# EAGLE design lamloei_node32s3wroom_cp2102_10_4layers (EAGLE 7.7.0)
CNAME: LamLoei Node32S3Wroom; CREVISION: R1; DESIGNER: lamloei co.,ltd.
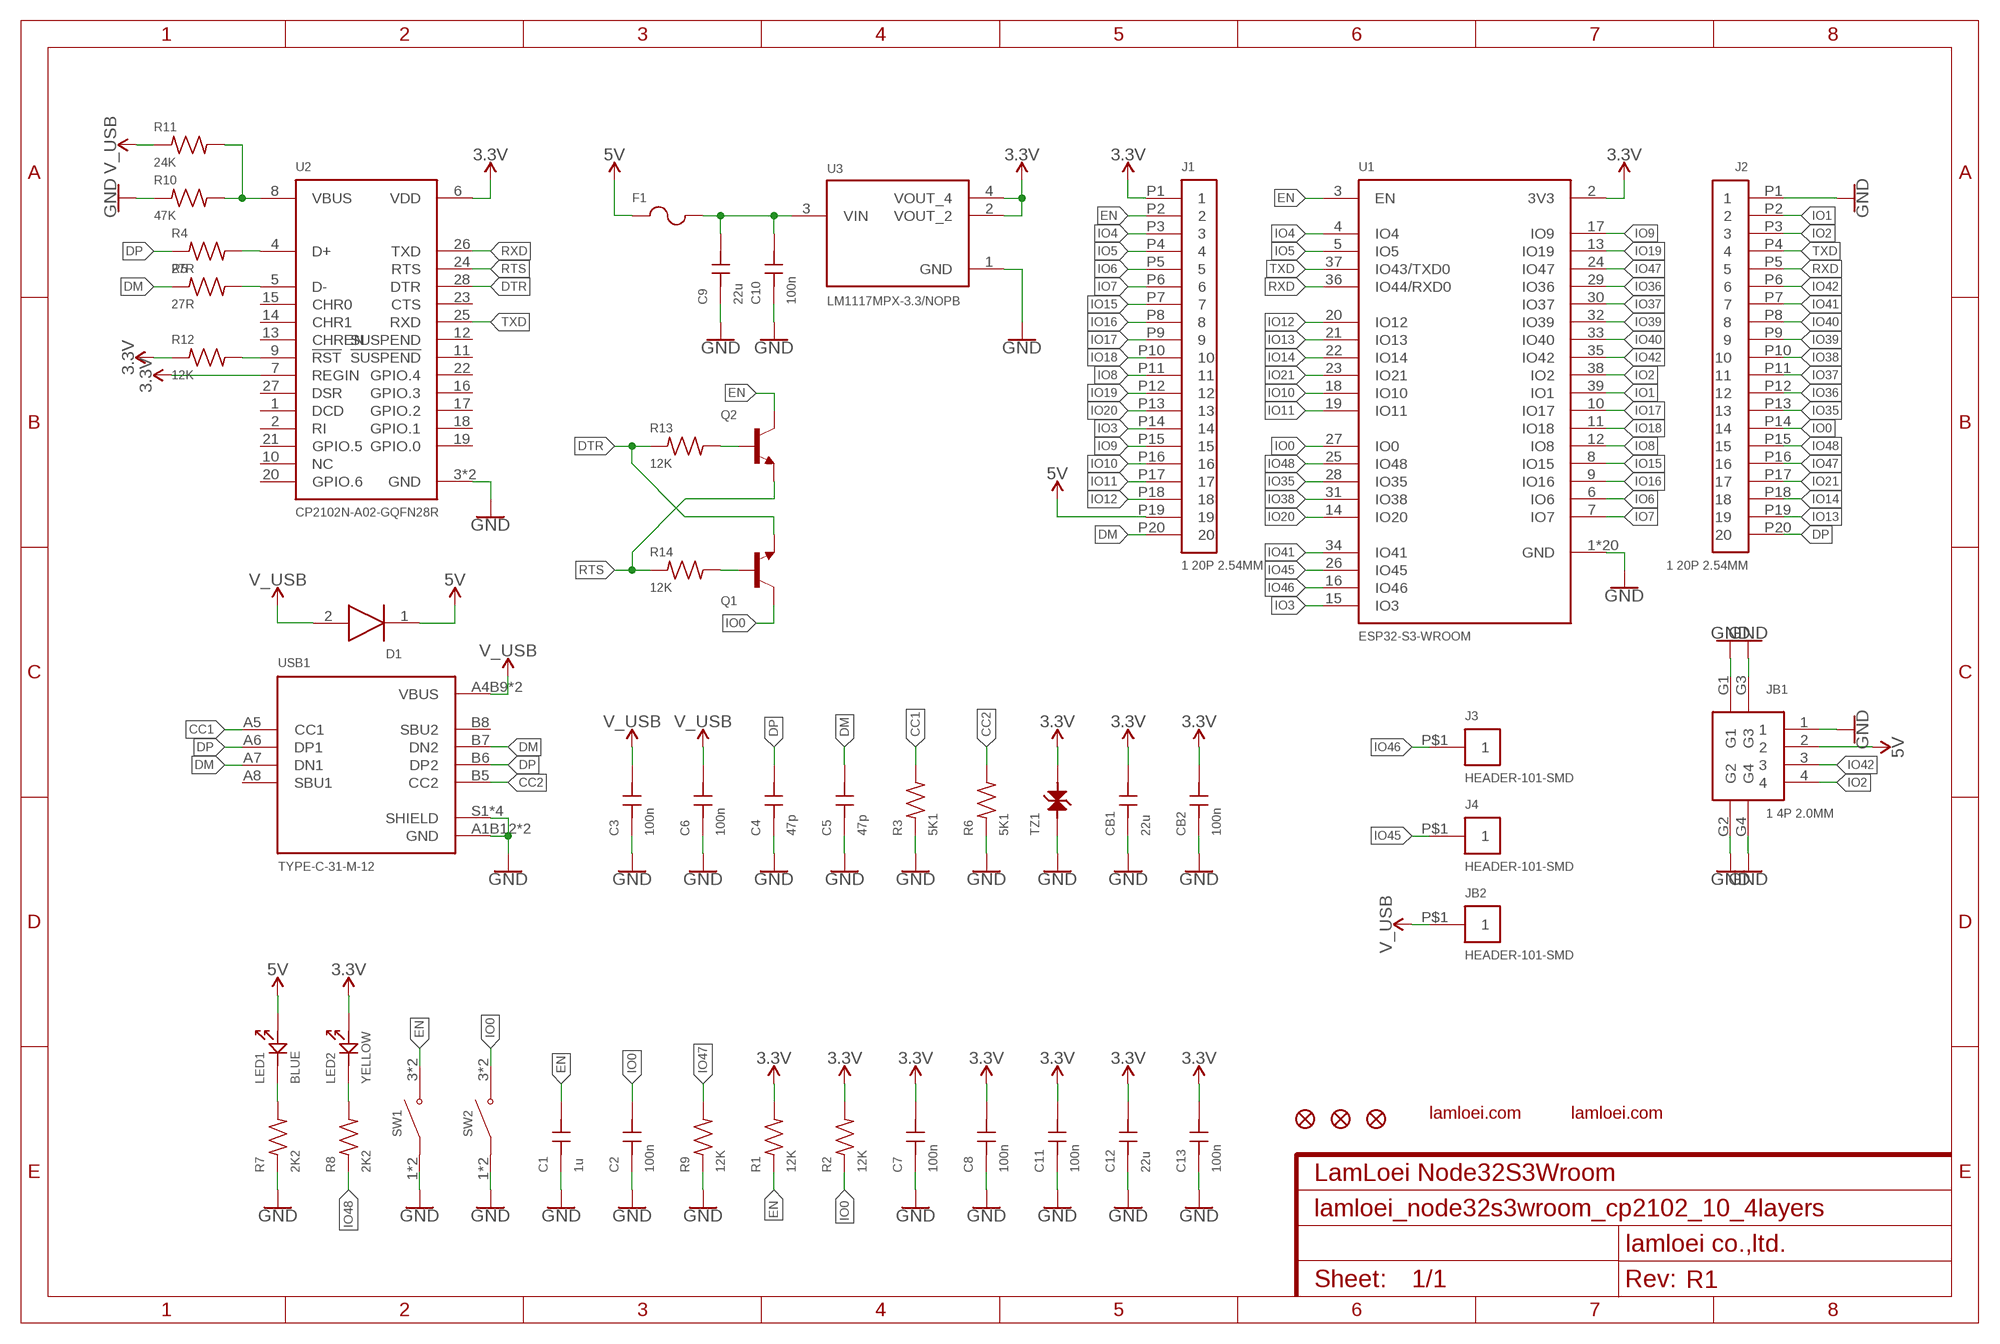
[diagram p0: schematic, sheet 1]

## Parts
C1  1u  GRM155R70J105KA12D  [GRM155R70J105KA12D]
C2  100n  GCM155R71H104KE02D  [GCM155R71H104KE02D]
C3  100n  GCM155R71H104KE02D  [GCM155R71H104KE02D]
C4  47p  GCM1555C1H470JA16D  [GCM1555C1H470JA16D]
C5  47p  GCM1555C1H470JA16D  [GCM1555C1H470JA16D]
C6  100n  GCM155R71H104KE02D  [GCM155R71H104KE02D]
C7  100n  GCM155R71H104KE02D  [GCM155R71H104KE02D]
C8  100n  GCM155R71H104KE02D  [GCM155R71H104KE02D]
C9  22u  GCM21BR71H105KA03L  [GCM21BR71H105KA03L]
C10  100n  GCM155R71H104KE02D  [GCM155R71H104KE02D]
C11  100n  GCM155R71H104KE02D  [GCM155R71H104KE02D]
C12  22u  GCM21BR71H105KA03L  [GCM21BR71H105KA03L]
C13  100n  GCM155R71H104KE02D  [GCM155R71H104KE02D]
CB1  22u  GCM21BR71H105KA03L  [GCM21BR71H105KA03L]
CB2  100n  GCM155R71H104KE02D  [GCM155R71H104KE02D]
D1  PMEG4050EP,115  [PMEG4050EP,115]
F1  MF-NSMF050-2  [MF-NSMF050-2]
J1  1 20P 2.54MM  HEADER-120  [HEADER-120]
J2  1 20P 2.54MM  HEADER-120  [HEADER-120]
J3  HEADER-101-SMD  [HEADER-101-SMD]
J4  HEADER-101-SMD  [HEADER-101-SMD]
JB1  1 4P 2.0MM  A2012WR-S-4P  [A2012WR-S-4P]
JB2  HEADER-101-SMD  [HEADER-101-SMD]
LED1  BLUE  19-217BHC-ZL1M2RY3T  [19-217BHC-ZL1M2RY3T]
LED2  YELLOW  19-213/Y2C-CQ2R2L/3T(CY)  [19-213/Y2C-CQ2R2L/3T(CY)]
Q1  BC847B,215  [BC847B,215]
Q2  BC847B,215  [BC847B,215]
R1  12K  RC0402FR-0712KL  [R0402]
R2  12K  RC0402FR-0712KL  [R0402]
R3  5K1  RC0402FR-075K1L  [R0402]
R4  27R  RC0402FR-0727RL  [R0402]
R5  27R  RC0402FR-0727RL  [R0402]
R6  5K1  RC0402FR-075K1L  [R0402]
R7  2K2  RC0402FR-072K2L  [R0402]
R8  2K2  RC0402FR-072K2L  [R0402]
R9  12K  RC0402FR-0712KL  [R0402]
R10  47K  RC0402FR-0747KL  [R0402]
R11  24K  RC0402FR-0724KL  [R0402]
R12  12K  RC0402FR-0712KL  [R0402]
R13  12K  RC0402FR-0712KL  [R0402]
R14  12K  RC0402FR-0712KL  [R0402]
SW1  K2-1808SN-A4SW-01  [K2-1808SN-A4SW-01]
SW2  K2-1808SN-A4SW-01  [K2-1808SN-A4SW-01]
TZ1  LXES15AAA1-153  [LXES15AAA1-153]
U1  ESP32-S3-WROOM  [ESP32-S3-WROOM]
U2  CP2102N-A02-GQFN28R  [CP2102N-A02-GQFN28R]
U3  LM1117MPX-3.3/NOPB  [LM1117MPX-3.3/NOPB]
USB1  TYPE-C-31-M-12  [TYPE-C-31-M-12]
ZFD1  FIDUCIAL1X2  [FIDUCIAL-1X2]
ZFD2  FIDUCIAL1X2  [FIDUCIAL-1X2]
ZFD3  FIDUCIAL1X2  [FIDUCIAL-1X2]
ZL1  LAMLEOI_LOGO_3  [LAMLEOI_LOGO_3]
ZL2  LAMLEOI_LOGO_3  [LAMLEOI_LOGO_3]

## Nets
3.3V: C7.2 C8.2 C11.2 C12.2 C13.2 CB1.2 CB2.2 J1.P1 LED2.2 R1.2 R2.2 R12.1 TZ1.2 U1.2(3V3) U2.6(VDD) U2.7(REGIN) U3.2(VOUT_2) U3.4(VOUT_4)
5V: D1.1(K) F1.1 J1.P19 JB1.2 LED1.2
CC1: R3.2 USB1.A5(CC1)
CC2: R6.2 USB1.B5(CC2)
DM: C5.2 J1.P20 R5.1 USB1.A7(DN1) USB1.B7(DN2)
DP: C4.2 J2.P20 R4.1 USB1.A6(DP1) USB1.B6(DP2)
DTR: Q1.E R13.1 U2.28(DTR)
EN: C1.2 J1.P2 Q2.C R1.1 SW1.3(NO) SW1.4(NO) U1.3(EN)
GND: C1.1 C2.1 C3.1 C4.1 C5.1 C6.1 C7.1 C8.1 C9.1 C10.1 C11.1 C12.1 C13.1 CB1.1 CB2.1 J2.P1 JB1.1 JB1.G1 JB1.G2 JB1.G3 JB1.G4 R3.1 R6.1 R7.1 R9.1 R10.1 SW1.1(COM) SW1.2(COM) SW2.1(COM) SW2.2(COM) TZ1.1 U1.1(GND) U1.1.1(GND) U1.1.2(GND) U1.1.3(GND) U1.1.4(GND) U1.1.5(GND) U1.1.6(GND) U1.1.7(GND) U1.1.8(GND) U1.1.9(GND) U1.1.10(GND) U1.1.11(GND) U1.1.12(GND) U1.1.13(GND) U1.1.14(GND) U1.1.15(GND) U1.1.16(GND) U1.1.17(GND) U1.1.18(GND) U1.40(GND) U2.3(GND) U2.29(GND) U3.1(GND) USB1.A1B12(GND) USB1.B1A12(GND) USB1.S1(SHIELD) USB1.S2(SHIELD) USB1.S3(SHIELD) USB1.S4(SHIELD)
IO0: C2.2 J2.P14 Q1.C R2.1 SW2.3(NO) SW2.4(NO) U1.27(IO0)
IO1: J2.P2 U1.39(IO1)
IO2: J2.P3 JB1.4 U1.38(IO2)
IO3: J1.P14 U1.15(IO3)
IO4: J1.P3 U1.4(IO4)
IO5: J1.P4 U1.5(IO5)
IO6: J1.P5 U1.6(IO6)
IO7: J1.P6 U1.7(IO7)
IO8: J1.P11 U1.12(IO8)
IO9: J1.P15 U1.17(IO9)
IO10: J1.P16 U1.18(IO10)
IO11: J1.P17 U1.19(IO11)
IO12: J1.P18 U1.20(IO12)
IO13: J2.P19 U1.21(IO13)
IO14: J2.P18 U1.22(IO14)
IO15: J1.P7 U1.8(IO15)
IO16: J1.P8 U1.9(IO16)
IO17: J1.P9 U1.10(IO17)
IO18: J1.P10 U1.11(IO18)
IO19: J1.P12 U1.13(IO19)
IO20: J1.P13 U1.14(IO20)
IO21: J2.P17 U1.23(IO21)
IO35: J2.P13 U1.28(IO35)
IO36: J2.P12 U1.29(IO36)
IO37: J2.P11 U1.30(IO37)
IO38: J2.P10 U1.31(IO38)
IO39: J2.P9 U1.32(IO39)
IO40: J2.P8 U1.33(IO40)
IO41: J2.P7 U1.34(IO41)
IO42: J2.P6 JB1.3 U1.35(IO42)
IO45: J4.P$1 U1.26(IO45)
IO46: J3.P$1 U1.16(IO46)
IO47: J2.P16 R9.2 U1.24(IO47)
IO48: J2.P15 R8.1 U1.25(IO48)
N$1: R5.2 U2.5(D-)
N$2: R4.2 U2.4(D+)
N$3: C9.2 C10.2 F1.2 U3.3(VIN)
N$4: LED1.1 R7.2
N$5: LED2.1 R8.2
N$6: Q2.B R13.2
N$7: Q1.B R14.2
N$8: R12.2 U2.9(!RST)
N$10: R10.2 R11.2 U2.8(VBUS)
RTS: Q2.E R14.1 U2.24(RTS)
RXD: J2.P5 U1.36(IO44/RXD0) U2.26(TXD)
TXD: J2.P4 U1.37(IO43/TXD0) U2.25(RXD)
V_USB: C3.2 C6.2 D1.2(A) JB2.P$1 R11.1 USB1.A4B9(VBUS) USB1.B4A9(VBUS)
Unconnected: U2.1(DCD) U2.2(RI) U2.10(NC) U2.11(!SUSPEND) U2.12(SUSPEND) U2.13(CHREN) U2.14(CHR1) U2.15(CHR0) U2.16(GPIO.3) U2.17(GPIO.2) U2.18(GPIO.1) U2.19(GPIO.0) U2.20(GPIO.6) U2.22(GPIO.4) U2.23(CTS) U2.27(DSR) USB1.A8(SBU1) USB1.B8(SBU2)

## Power pins joined to a net without a drawn wire
GPIO.5: U2.21(GPIO.5)

## Library data of the parts
C1 = lamloei_e77_GRM155R70J105KA12D:GRM155R70J105KA12D; MANUFACTURER_PART_NUMBER: GRM155R70J105KA12D; VENDOR: Murata
C2 C3 C6-C8 C10 C11 C13 CB2 = lamloei_e77_GCM155R71H104KE02D:GCM155R71H104KE02D; MANUFACTURER_PART_NUMBER: GCM155R71H104KE02D; VENDOR: Murata
C4 C5 = lamloei_e77_GCM1555C1H470JA16D:GCM1555C1H470JA16D; MANUFACTURER_PART_NUMBER: GCM1555C1H470JA16D; VENDOR: Murata
C9 C12 CB1 = lamloei_e77_GCM21BR71H105KA03L:GCM21BR71H105KA03L; MANUFACTURER_PART_NUMBER: GCM21BR71H105KA03L; VENDOR: Murata
D1 = lamloei_e77_PMEG4050EP_115:PMEG4050EP,115: Nexperia PMEG4050EP,115 SMT Schottky Diode, 40V 5A, 2-Pin SOD-128 Source: Datasheet <http://uk.rs-online.com/web/p/products/7805405P>; DESCRIPTION: Nexperia PMEG4050EP,115 SMT Schottky Diode, 40V 5A, 2-Pin SOD-128; HEIGHT: 1.1mm; MANUFACTURER_NAME: Nexperia; MANUFACTURER_PART_NUMBER: PMEG4050EP,115; RS_PART_NUMBER: 7805405P; RS_PRICE-STOCK: http://uk.rs-online.com/web/p/products/7805405P
F1 = lamloei_e77_mf-nsmf050-2-noretrict:MF-NSMF050-2; DATASHEET: https://datasheet.lcsc.com/lcsc/1809212037_BOURNS-MF-NSMF050-2_C75464.pdf; DESCRIPTIONS: 13.2V 1A 1206 PTC Resettable Fuses; LCSC_PART: C75464; MANUFACTURER: BOURNS; MANUFACTURER_PART_NUMBER: MF-NSMF050-2; OPERATION_TEMPERATURE: -40°C ~ +85°C; OPERATION_TEMPERATURE_HIGH: +85°C; OPERATION_TEMPERATURE_LOW: -40°C; PACKAGE: 1206; PCBA_COST: Extended
J1 = lamloei_e77_HEADER-120A:HEADER-120
J2 = lamloei_e77_HEADER-120B:HEADER-120
J3 J4 JB2 = lamloei_e77_HEADER-101-SMD:HEADER-101-SMD
JB1 = lamloei_e77_a2012wr-s-4p:A2012WR-S-4P
LED1 = lamloei_e77_19-217BHC-ZL1M2RY3T:19-217BHC-ZL1M2RY3T; MANUFACTURER_PART_NUMBER: 19-217BHC-ZL1M2RY3T; VENDOR: Everlight Elec
LED2 = lamloei_e77_19-213Y2C-CQ2R2L3T(CY):19-213/Y2C-CQ2R2L/3T(CY); MANUFACTURER_PART_NUMBER: 19-213/Y2C-CQ2R2L/3T(CY); VENDOR: Everlight Elec
Q1 Q2 = lamloei_e77_bc847b_215:BC847B,215; AVAILABILITY: In Stock; DESCRIPTION: Bipolar (BJT) Transistor NPN 45V 100mA 100MHz 300mW Surface Mount SOT-23-3 (TO-236); MF: ON Semiconductor; MP: BC847BLT3G; PACKAGE: SOT-23-3 ON Semiconductor; PRICE: None
R1 R2 R9 R12-R14 = lamloei_e77_rc0402fr-0712kl:RC0402FR-0712KL; DATASHEET: https://datasheet.lcsc.com/lcsc/1811081726_YAGEO-RC0402FR-0712KL_C114760.pdf; DESCRIPTIONS: 12kΩ ±1% 0.0625W ±100ppm/°C; DIELECTRIC: X7R; LCSC_PART: C114760; MANUFACTURER: YAGEO; MANUFACTURER_PART_NUMBER: RC0402FR-0712KL; OPERATION_POWER: 1/16W; OPERATION_TEMPERATURE: -55°C ~ +155°C; OPERATION_TEMPERATURE_HIGH: +155°C; OPERATION_TEMPERATURE_LOW: -55°C; PACKAGE: 0402; PCBA_COST: EXTENDED; RATED_VOLTAGE: 100VDC; RESISTANCE: 12kΩ; TOLERANCE: ±1%
R3 R6 = lamloei_e77_rc0402fr-075k1l:RC0402FR-075K1L; DATASHEET: https://datasheet.lcsc.com/lcsc/1809201112_YAGEO-RC0402FR-075K1L_C105872.pdf; DESCRIPTIONS: 5.1kΩ ±1% 0.0625W ±100ppm/°C; DIELECTRIC: X7R; LCSC_PART: C105872; MANUFACTURER: YAGEO; MANUFACTURER_PART_NUMBER: RC0402FR-075K1L; OPERATION_POWER: 1/16W; OPERATION_TEMPERATURE: -55°C ~ +155°C; OPERATION_TEMPERATURE_HIGH: +155°C; OPERATION_TEMPERATURE_LOW: -55°C; PACKAGE: 0402; PCBA_COST: EXTENDED; RATED_VOLTAGE: 100VDC; RESISTANCE: 5.1kΩ; TOLERANCE: ±1%
R4 R5 = lamloei_e77_rc0402fr-0727rl:RC0402FR-0727RL; DATASHEET: https://datasheet.lcsc.com/lcsc/1810241334_YAGEO-RC0402FR-0727RL_C138021.pdf; DESCRIPTIONS: 27Ω ±1% 0.0625W ±100ppm/°C; DIELECTRIC: X7R; LCSC_PART: C138021; MANUFACTURER: YAGEO; MANUFACTURER_PART_NUMBER: RC0402FR-0727RL; OPERATION_POWER: 1/16W; OPERATION_TEMPERATURE: -55°C ~ +155°C; OPERATION_TEMPERATURE_HIGH: +155°C; OPERATION_TEMPERATURE_LOW: -55°C; PACKAGE: 0402; PCBA_COST: EXTENDED; RATED_VOLTAGE: 100VDC; RESISTANCE: 27Ω; TOLERANCE: ±1%
R7 R8 = lamloei_e77_rc0402fr-072k2l:RC0402FR-072K2L; DATASHEET: https://datasheet.lcsc.com/lcsc/1809201112_YAGEO-RC0402FR-072K2L_C114762.pdf; DESCRIPTIONS: 2.2kΩ ±1% 0.0625W ±100ppm/°C; DIELECTRIC: X7R; LCSC_PART: C114762; MANUFACTURER: YAGEO; MANUFACTURER_PART_NUMBER: RC0402FR-072K2L; OPERATION_POWER: 1/16W; OPERATION_TEMPERATURE: -55°C ~ +155°C; OPERATION_TEMPERATURE_HIGH: +155°C; OPERATION_TEMPERATURE_LOW: -55°C; PACKAGE: 0402; PCBA_COST: EXTENDED; RATED_VOLTAGE: 100VDC; RESISTANCE: 2.2kΩ; TOLERANCE: ±1%
R10 = lamloei_e77_rc0402fr-0747kl:RC0402FR-0747KL; DATASHEET: https://datasheet.lcsc.com/lcsc/1811011510_YAGEO-RC0402FR-0747KL_C93943.pdf; DESCRIPTIONS: 47kΩ ±1% 0.0625W ±100ppm/°C; DIELECTRIC: X7R; LCSC_PART: C93943; MANUFACTURER: YAGEO; MANUFACTURER_PART_NUMBER: RC0402FR-0747KL; OPERATION_POWER: 1/16W; OPERATION_TEMPERATURE: -55°C ~ +155°C; OPERATION_TEMPERATURE_HIGH: +155°C; OPERATION_TEMPERATURE_LOW: -55°C; PACKAGE: 0402; PCBA_COST: EXTENDED; RATED_VOLTAGE: 100VDC; RESISTANCE: 47kΩ; TOLERANCE: ±1%
R11 = lamloei_e77_rc0402fr-0724kl:RC0402FR-0724KL; DATASHEET: https://datasheet.lcsc.com/lcsc/1810241334_YAGEO-RC0402FR-0724KL_C138026.pdf; DESCRIPTIONS: 24kΩ ±1% 0.0625W ±100ppm/°C; DIELECTRIC: X7R; LCSC_PART: C138026; MANUFACTURER: YAGEO; MANUFACTURER_PART_NUMBER: RC0402FR-0724KL; OPERATION_POWER: 1/16W; OPERATION_TEMPERATURE: -55°C ~ +155°C; OPERATION_TEMPERATURE_HIGH: +155°C; OPERATION_TEMPERATURE_LOW: -55°C; PACKAGE: 0402; PCBA_COST: EXTENDED; RATED_VOLTAGE: 100VDC; RESISTANCE: 24kΩ; TOLERANCE: ±1%
SW1 SW2 = lamloei_e77_K2-1808SN-A4SW-01:K2-1808SN-A4SW-01: Check prices <https://pricing.snapeda.com/parts/4-1437565-2/TE%20Connectivity/view-part?ref=eda>; AVAILABILITY: In Stock; COMMENT: 4-1437565-2; CONFIGURATION_POLE-THROW: Single Pole - Single Throw; CONTACT_CURRENT_RATING: 50 mA; DESCRIPTION: Tactile Switch SPST-NO Top Actuated Surface Mount; EU_ROHS_COMPLIANCE: Compliant; MF: TE Connectivity; MP: 4-1437565-2; PACKAGE: None; PRICE: None
TZ1 = lamloei_e77_lxes15aaa1-153:LXES15AAA1-153; DATASHEET: https://datasheet.lcsc.com/lcsc/1811081617_Murata-Electronics-LXES15AAA1-153_C86141.pdf; DESCRIPTIONS: Bidirectional 4V 0402 Diodes - ESD; LCSC_PART: C86141; MANUFACTURER: Murata; MANUFACTURER_PART_NUMBER: LXES15AAA1-153; OPERATION_TEMPERATURE: -40°C ~ +85°C; OPERATION_TEMPERATURE_HIGH: +85°C; OPERATION_TEMPERATURE_LOW: -40°C; PACKAGE: 0402; PCBA_COST: EXTENDED; RATED_VOLTAGE: 4V
U1 = lamloei_e77_ESP32-S3-WROOM-ANT:ESP32-S3-WROOM: Module: combo; GPIO, I2C x2, I2S x2, SDIO, SPI x3, UART x3; 19.5dBm; AVAILABILITY: Warning; DESCRIPTION: Module: combo; GPIO, I2C x2, I2S x2, SDIO, SPI x3, UART x3; 19.5dBm; MF: Olimex LTD; MP: ESP-WROOM-32; PACKAGE: Module Espressif Systems; PRICE: 4.57 USD
U2 = lamloei_e77_cp2102n-a02-gqfn24r:CP2102N-A02-GQFN28R
U3 = lamloei_e77_LM1117MPX-3.3_NOPB:LM1117MPX-3.3/NOPB: 800-mA 15-V linear voltage regulator 4-SOT-223 0 to 125 Check prices <https://pricing.snapeda.com/parts/LM1117MPX-3.3/NOPB/Texas%20Instruments/view-part?ref=eda>; AVAILABILITY: In Stock; DESCRIPTION: 800-mA 15-V linear voltage regulator 4-SOT-223 0 to 125; MF: Texas Instruments; MP: LM1117MPX-3.3/NOPB; PACKAGE: SOT-223-4 Texas Instruments; PRICE: None; PURCHASE-URL: https://pricing.snapeda.com/search/part/LM1117MPX-3.3/NOPB/?ref=eda
USB1 = _lamloei_e77_TYPE-C-31-M-12:TYPE-C-31-M-12; AVAILABILITY: Unavailable; DESCRIPTION: USB Connectors 24 Receptacle 1 8.94*7.3mm RoHS; DIFFX: 1.75; DIFFY: -3.53; MF: HRO Electronics Co., Ltd.; MP: TYPE-C-31-M-12; PACKAGE: Package; PRICE: None
ZFD1-ZFD3 = SparkFun-Aesthetics:FIDUCIAL: Fiducial Alignment Points Point-of-reference for pick-and-place machines and other optical instruments.
ZL1 ZL2 = lamloei_logo_3:LAMLEOI_LOGO_3: lamloei

## Board
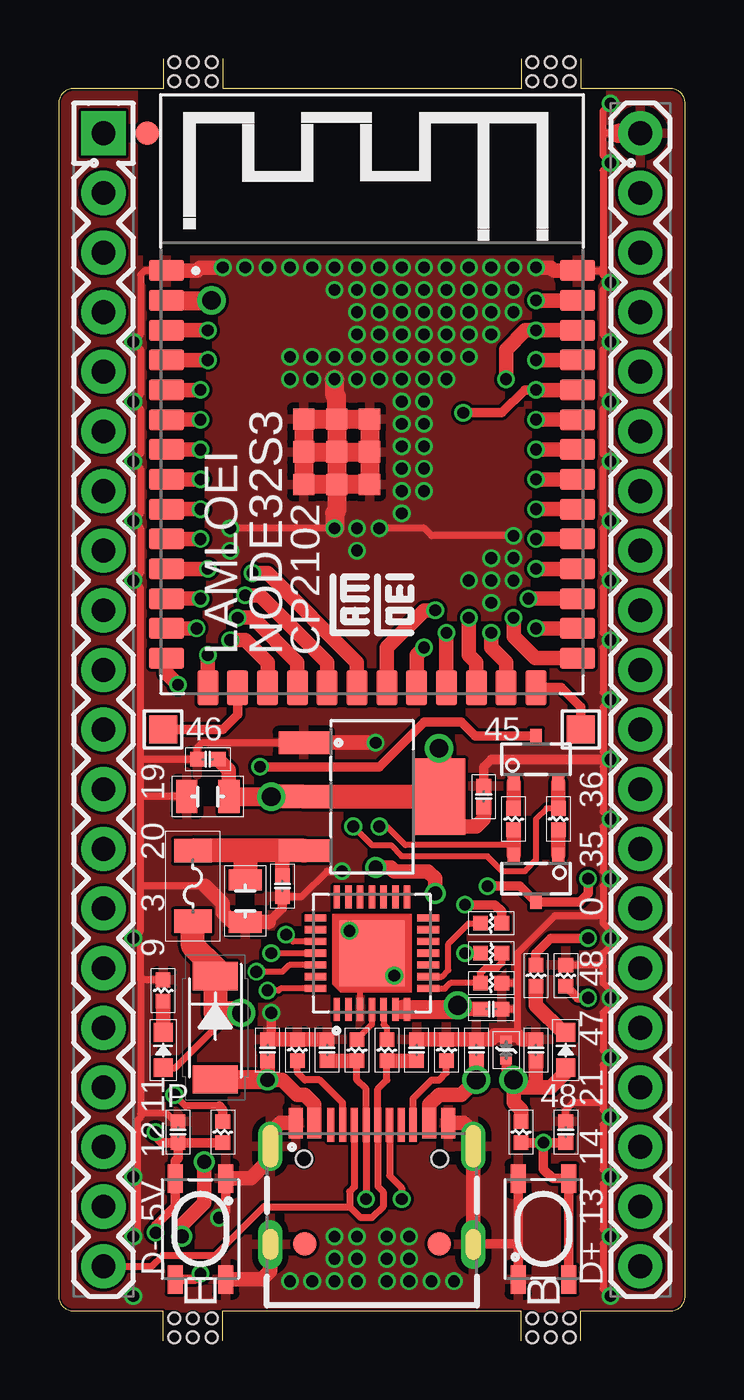
[diagram p1: board, top side]
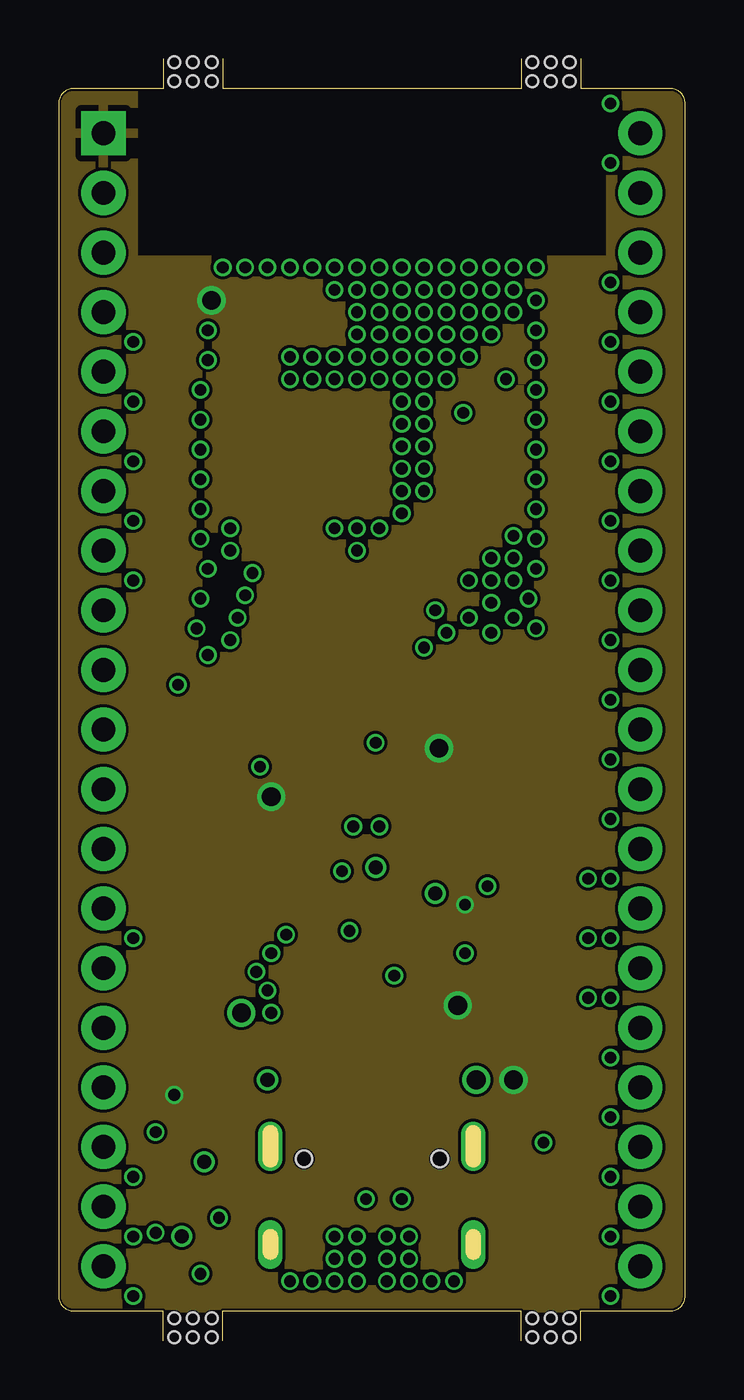
[diagram p2: board, inner layer Route2]
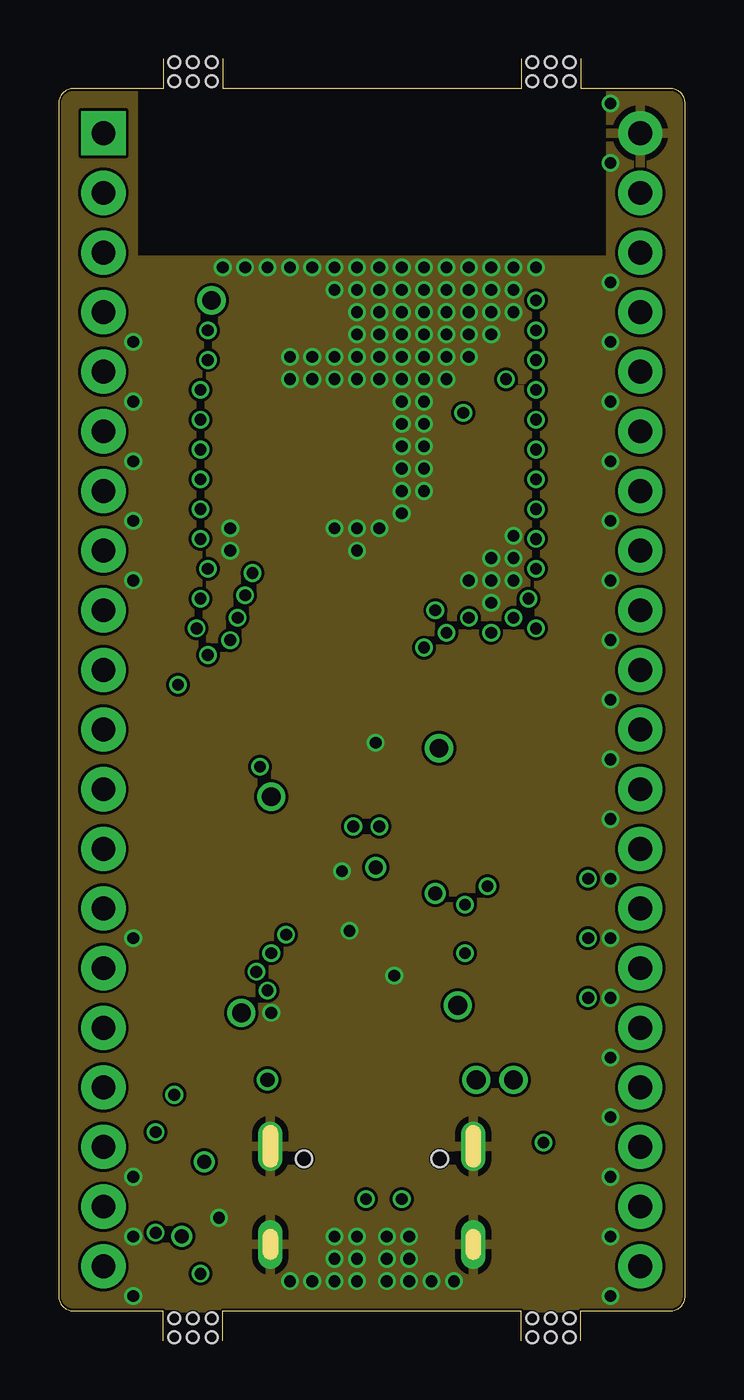
[diagram p3: board, inner layer Route15]
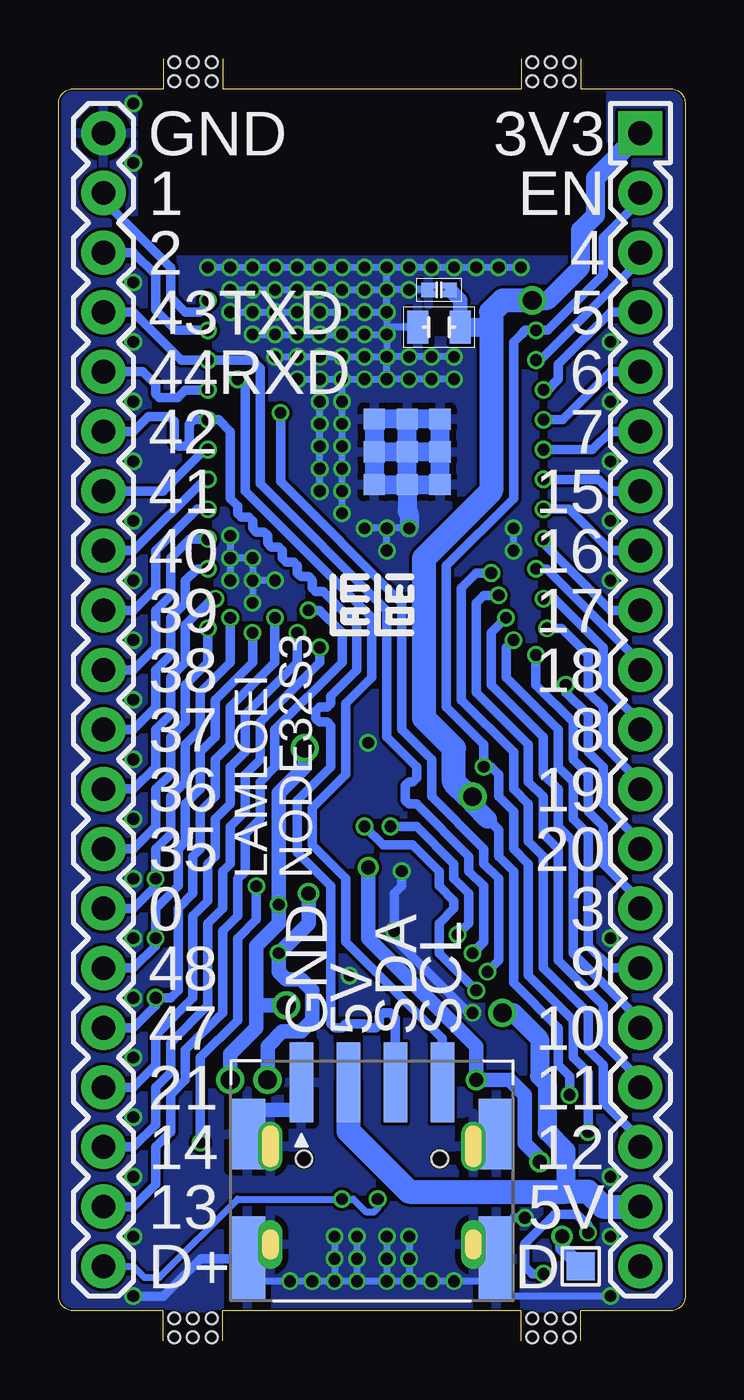
[diagram p4: board, bottom side, seen from below]

Size 26.67 x 54.61 mm. Coordinates in mm from the lower left corner, seen from the top.
Outline: 4.45,0 4.45,1.27 0.64,1.27 arc-90 0,1.91 0,52.71 arc-90 0.64,53.34 4.45,53.34 4.45,54.61
Outline: 6.99,0 6.99,1.27 19.68,1.27 19.68,0
Outline: 22.23,0 22.23,1.27 26.04,1.27 arc90 26.67,1.91 26.67,52.71 arc90 26.04,53.34 22.23,53.34 22.23,54.61
Outline: 6.99,54.61 6.99,53.34 19.68,53.34 19.68,54.61
Copper layers (1*2*15*16): Top 0.035559375mm / dielectric 0.17018125mm / Route2 0.01778125mm / dielectric 47mil / Route15 0.01778125mm / dielectric 0.17018125mm / Bottom 0.035559375mm
Design rules "jlcpcb-4-layer": minimum track width 5mil, minimum drill 0.2mm, track to track 0.126490625mm, track to pad 0.126490625mm, pad to pad 0.126490625mm, via to via 0.126490625mm, smd to smd 0mil, copper to edge 0.1mm, drill to drill 5mil, minimum pad ring 4mil, minimum via ring 4mil, stop-mask expansion 3mil, vias tented up to drill 100mil, thermal gap 10mil
Holes 0.5 mm at 5.71,0.95 20.95,0.95 5.71,53.66 20.95,53.66 4.92,0.95 6.51,0.95 20.16,0.95 21.75,0.95 21.75,53.66 20.16,53.66 4.92,53.66 6.51,53.66 4.92,54.45 5.71,54.45 6.51,54.45 20.16,54.45 20.95,54.45 21.75,54.45 20.16,0.16 20.95,0.16 21.75,0.16 4.92,0.16 5.71,0.16 6.51,0.16

### Footprints (pad centres in the part's own frame; a part is rotated, then mirrored left to right if it is on the bottom)
GRM155R70J105KA12D = smd 0.62 x 0.62: 1 -0.45,0; 2 0.45,0
GCM155R71H104KE02D = smd 0.62 x 0.62: 1 -0.45,0; 2 0.45,0
GCM1555C1H470JA16D = smd 0.62 x 0.62: 1 -0.45,0; 2 0.45,0
GCM21BR71H105KA03L = smd 0.9 x 1.4: 1 -0.9,0; 2 0.9,0
PMEG4050EP,115 = smd 1.2 x 1.9: 1 -2.2,0; 2 2.2,0
MF-NSMF050-2 = smd 1 x 1.6: 1 -1.5,0; 2 1.5,0
HEADER-120 = drill 1.016 pad 1.88 square: P1 24.13,0 | drill 1.016 pad 1.88: P2 21.59,0; P3 19.05,0; P4 16.51,0; P5 13.97,0; P6 11.43,0; P7 8.89,0; P8 6.35,0; P9 3.81,0; P10 1.27,0; P11 -1.27,0; P12 -3.81,0; P13 -6.35,0; P14 -8.89,0; P15 -11.43,0; P16 -13.97,0; P17 -16.51,0; P18 -19.05,0; P19 -21.59,0; P20 -24.13,0
HEADER-120' = drill 1.016 pad 1.88: P1 24.13,0; P2 21.59,0; P3 19.05,0; P4 16.51,0; P5 13.97,0; P6 11.43,0; P7 8.89,0; P8 6.35,0; P9 3.81,0; P10 1.27,0; P11 -1.27,0; P12 -3.81,0; P13 -6.35,0; P14 -8.89,0; P15 -11.43,0; P16 -13.97,0; P17 -16.51,0; P18 -19.05,0; P19 -21.59,0; P20 -24.13,0
HEADER-101-SMD = smd 1.2 x 1.2: P$1 0,0
A2012WR-S-4P = smd 1 x 3.4: 1 -3,3.7; 2 -1,3.7; 3 1,3.7; 4 3,3.7 | smd 1.5 x 3.6: G1 -5.3,-3.8; G2 5.3,-3.8 | smd 1.5 x 3: G3 -5.3,1.5; G4 5.3,1.5
19-217BHC-ZL1M2RY3T = smd 0.8 x 0.8: 1 -0.75,0; 2 0.75,0
19-213/Y2C-CQ2R2L/3T(CY) = smd 0.8 x 0.8: 1 -0.75,0; 2 0.75,0
BC847B,215 = smd 0.6 x 0.5: B 1,-0.95; C -1,0; E 1,0.95
R0402 = smd 0.62 x 0.62: 1 -0.45,0; 2 0.45,0
K2-1808SN-A4SW-01 = smd 1.2 x 0.65: 1 -2.15,1.075; 2 2.15,1.075; 3 -2.15,-1.075; 4 2.15,-1.075
LXES15AAA1-153 = smd 0.4 x 0.5: 1 -0.4,0; 2 0.4,0
ESP32-S3-WROOM = smd 0.9 x 1.5: 1 -5.26,-8.75; 2 -3.99,-8.75; 3 -2.72,-8.75; 4 -1.45,-8.75; 5 -0.18,-8.75; 6 1.09,-8.75; 7 2.36,-8.75; 8 3.63,-8.75; 9 4.9,-8.75; 10 6.17,-8.75; 11 7.44,-8.75; 12 8.71,-8.75; 13 9.98,-8.75; 14 11.25,-8.75; 27 11.25,8.75; 28 9.98,8.75; 29 8.71,8.75; 30 7.44,8.75; 31 6.17,8.75; 32 4.9,8.75; 33 3.63,8.75; 34 2.36,8.75; 35 1.09,8.75; 36 -0.18,8.75; 37 -1.45,8.75; 38 -2.72,8.75; 39 -3.99,8.75; 40 -5.26,8.75 | smd 0.9 x 0.9: 1.1 1.06,-2.9; 1.2 1.06,-1.5; 1.3 1.06,-0.1; 1.4 2.46,-2.9; 1.5 2.46,-1.5; 1.6 2.46,-0.1; 1.7 3.86,-2.9; 1.8 3.86,-1.5; 1.9 3.86,-0.1 | smd 0.9 x 0.9 bottom: 1.10 1.06,-2.9; 1.11 1.06,-1.5; 1.12 1.06,-0.1; 1.13 2.46,-2.9; 1.14 2.46,-1.5; 1.15 2.46,-0.1; 1.16 3.86,-2.9; 1.17 3.86,-1.5; 1.18 3.86,-0.1 | smd 1.5 x 0.9: 15 12.5,-6.985; 16 12.5,-5.715; 17 12.5,-4.445; 18 12.5,-3.175; 19 12.5,-1.905; 20 12.5,-0.635; 21 12.5,0.635; 22 12.5,1.905; 23 12.5,3.175; 24 12.5,4.445; 25 12.5,5.715; 26 12.5,6.985
CP2102N-A02-GQFN28R = smd 0.95 x 0.29: 1 -2.4,1.5; 2 -2.4,1; 3 -2.4,0.5; 4 -2.4,0; 5 -2.4,-0.5; 6 -2.4,-1; 7 -2.4,-1.5; 15 2.4,-1.5; 16 2.4,-1; 17 2.4,-0.5; 18 2.4,0; 19 2.4,0.5; 20 2.4,1; 21 2.4,1.5 | smd 0.29 x 0.95: 8 -1.5,-2.4; 9 -1,-2.4; 10 -0.5,-2.4; 11 0,-2.4; 12 0.5,-2.4; 13 1,-2.4; 14 1.5,-2.4; 22 1.5,2.4; 23 1,2.4; 24 0.5,2.4; 25 0,2.4; 26 -0.5,2.4; 27 -1,2.4; 28 -1.5,2.4 | smd 2.8 x 2.8: 29 0,0
LM1117MPX-3.3/NOPB = smd 2.15 x 0.95: 1 2.9,-2.3; 2 2.9,0; 3 2.9,2.3 | smd 2.15 x 3.25: 4 -2.9,0
TYPE-C-31-M-12 = smd 0.6 x 1.3: A1B12 3.25,-3.56; A4B9 2.45,-3.56; B1A12 -3.25,-3.56; B4A9 -2.45,-3.56 | smd 0.3 x 1.45: A5 1.25,-3.485; A6 0.25,-3.485; A7 -0.25,-3.485; A8 -1.25,-3.485; B5 -1.75,-3.485; B6 -0.75,-3.485; B7 0.75,-3.485; B8 1.75,-3.485 | drill 0.65 pad 1.05 long: S1 4.32,-2.57; S2 -4.32,-2.57; S3 4.32,1.61; S4 -4.32,1.61 | hole 0.7: 2.89,-2.04; -2.89,-2.04
FIDUCIAL-1X2 = smd 1 x 1: 1 0,0

### Placement (x,y rotation side)
C1  5.08,8.89 270 top
C2  21.59,8.89 270 top
C3  8.89,12.38 270 top
C4  11.43,12.38 270 top
C5  15.24,12.38 270 top
C6  17.78,12.38 270 top
C7  20.32,12.38 270 top
C8  18.41,14.13 180 top
C9  7.94,18.73 90 top
C10  9.53,19.37 90 top
C11  18.1,23.18 270 top
C12  6.35,23.18 0 top
C13  6.35,24.77 0 top
CB1  10.48,43.18 0 bottom
CB2  10.48,44.77 0 bottom
D1  6.67,13.33 270 top
F1  5.71,19.37 90 top
J1  1.91,27.3 90 top
J2  1 20P 2.54MM  [HEADER-120']  24.77,27.3 90 top
J3  4.45,26.04 0 top
J4  22.23,26.04 0 top
JB1  13.34,7.3 0 bottom
JB2  4.45,3.17 0 bottom
LED1  4.45,12.38 270 top
LED2  21.59,12.38 270 top
Q1  20.32,19.68 90 top
Q2  20.32,24.77 270 top
R1  6.99,8.89 90 top
R2  19.68,8.89 90 top
R3  10.16,12.38 270 top
R4  12.7,12.38 90 top
R5  13.97,12.38 90 top
R6  16.51,12.38 270 top
R7  4.45,14.92 270 top
R8  20.32,15.56 270 top
R9  21.59,15.56 270 top
R10  18.41,15.24 180 top
R11  18.41,16.51 0 top
R12  18.41,17.78 180 top
R13  19.37,22.22 90 top
R14  21.27,22.22 270 top
SW1  6.03,4.76 270 top
SW2  20.64,4.76 90 top
TZ1  19.05,12.38 270 top
U1  13.34,40.32 270 top
U2  13.34,16.51 90 top
U3  13.34,23.18 180 top
USB1  13.34,5.71 180 top
ZFD1  3.77,51.44 0 top
ZFD2  10.48,4.13 0 top
ZFD3  16.19,4.13 0 top
ZL1  11.35,29.84 0 top
ZL2  15.32,29.84 0 bottom

### Tracks (layer width: path | path; a pad name or v marks a point on that pad's centre or on a via)
3.3V  (via drill 0.5, 0.8)
  Top 0.254: 12.34,23.18 12.38,23.18 | U2.6 U2.7
  Top 0.305: 6.83,10 5.4,10 v4.92,10.48
  Top 0.406: TZ1.2 19.05,11.43 v19.37,11.11 | R1.2 6.99,9.84 6.83,10 | R12.1 18.86,18.28 18.57,18.57 v17.3,18.57
  Top 0.61: R2.2 19.68,9.84 19.37,10.16 v19.37,11.11 19.37,10.79 20.32,10.79 | LED2.2 21.59,11.43 20.95,10.79 20.32,10.79 | C7.2 20.32,10.79 | C12.2 7.25,24.32 C13.2 | 16.19,22.73 16.19,23.81 | C11.2 18.1,22.22 17.78,21.91 16.23,21.91 U3.4 | C8.2 17.14,14.13 v16.99,14.29
  Top 0.813: U1.2 v6.51,44.31 | C12.2 v9.05,23.18 | v16.99,14.29 16.81,14.11 U2.7 14.61,14.11
  Top 1.016: v16.19,25.24 16.19,23.81 16.19,23.18 U3.4 12.38,23.18 U3.2 v9.05,23.18
  Bottom 0.406: 9.05,22.86 v9.05,23.18 | 8.41,22.22 7.94,21.75 7.94,20.64 7.3,20 7.3,15.24 5.4,13.33 5.4,11.75 4.92,11.27 v4.92,10.48
  Bottom 0.61: v16.19,25.24 16.19,24.45 17.3,23.34 v17.3,18.57 17.3,17.78 18.26,16.83 18.26,14.29 | CB1.2 9.58,44.32 CB2.2 | v19.37,11.11 19.37,12.22 18.26,13.33 18.26,14.29 | 18.26,14.29 v16.99,14.29
  Bottom 0.813: v6.51,44.31 5.85,44.31 4.45,45.72 4.45,47.31 3.81,47.94 3.81,49.53 J1.P1 | CB1.2 8.26,43.18 | 8.41,22.22 9.05,22.86
  Bottom 1.016: v6.51,44.31 7.76,44.31 8.26,43.82 8.26,43.18 8.26,36.2 11.11,33.34 11.11,26.51 9.84,25.24 9.84,23.81 9.21,23.18 v9.05,23.18
  pour Route2: 0,1.27 26.67,1.27 26.67,53.34 23.5,53.34 23.5,46.04 3.17,46.04 3.17,53.34 0,53.34
5V  (via drill 0.8)
  Top 0.305: LED1.2 4.96,11.63 6.67,13.33 6.67,13.97
  Top 1.016: F1.1 5.71,16.83 6.67,15.88 D1.1 6.67,13.97 v7.78,13.97
  Bottom 0.813: 5.08,6.35 5.08,6.51 5.08,8.1 5.87,8.89 5.87,10.95 6.19,11.27 6.19,12.86 7.3,13.97 v7.78,13.97
  Bottom 1.016: J1.P19 3.49,5.71 4.13,6.35 5.08,6.35 11.75,6.35 14.34,8.94 JB1.2
CC1
  Top 0.305: USB1.A5 12.09,10.14 11.11,11.11 10.48,11.11 10.16,11.43 R3.2
CC2
  Top 0.305: USB1.B5 15.09,10.32 15.88,11.11 16.19,11.11 16.51,11.43 R6.2
DM
  Top 0.305: R5.1 13.97,11.11 13.59,10.73 USB1.A7 13.59,6.58 13.81,6.35 13.81,5.71 13.34,5.24 12.86,5.24 12.38,5.71 | J1.P20 3.97,3.17 4.45,3.65 6.67,3.65 8.73,5.71 12.38,5.71 | USB1.B7 12.59,6.55 12.38,6.35 12.38,5.71
  Top 0.61: R5.1 C5.2
DP  (via drill 0.5)
  Top 0.305: R4.1 12.7,11.11 13.09,10.73 USB1.A6 v13.09,6.03 | USB1.B6 14.09,7.03 14.61,6.51 v14.61,6.03
  Top 0.61: C4.2 R4.1
  Bottom 0.305: J2.P20 23.5,3.17 23.02,2.7 22.38,2.7 19.05,6.03 v14.61,6.03 14.13,6.03 13.57,5.48 13.26,5.48 13.09,5.65 v13.09,6.03
DTR  (via drill 0.5)
  Top 0.254: Q1.E 19.37,20.95 | 19.37,21.27 19.37,21.11 14.76,21.11 13.97,21.91 v13.65,21.91 | U2.28 9.45,15.01 9.37,14.92 v8.89,14.92
  Top 0.61: R13.1 | Q1.E 19.37,21.11 19.37,21.27 R13.1
  Bottom 0.406: v8.89,14.92 10.48,16.51 10.48,17.78 9.84,18.41 9.84,18.73 10.48,19.37 10.48,20 11.59,21.11 12.86,21.11 v13.65,21.91
EN  (via drill 0.5)
  Top 0.406: Q2.C 17.73,25.77 17.14,26.35 15.56,26.35 13.65,24.45 v8.57,24.45 | R1.1 C1.2 | C1.2 5.08,7.78 4.96,7.66 SW1.3 4.96,5.75 4.13,4.92 v4.13,4.6 | C1.2 4.42,8.44 4.13,8.73 v4.13,8.89 | SW1.4 5.79,2.61 v6.03,2.86
  Top 0.61: U1.3 v6.35,43.04
  Bottom 0.406: J1.P2 1.91,48.58 3.49,46.99 3.49,45.4 5.85,43.04 v6.35,43.04 6.8,43.04 6.99,42.86 7.3,42.55 7.3,35.88 10.16,33.02 10.16,26.99 8.57,25.4 v8.57,24.45 8.26,24.45 7.94,24.13 7.94,23.18 7.3,22.54 7.3,20.95 6.67,20.32 6.67,15.56 4.76,13.65 4.76,12.06 4.13,11.43 v4.13,8.89 | v4.13,4.6 4.13,4.92 4.6,5.4 5.56,5.4 6.67,4.29 6.83,4.13 6.83,3.17 6.51,2.86 v6.03,2.86
GND  (via drill 0.5)
  Top 0.254: U2.3 12.84,16.51 U2.29
  Top 0.305: 23.18,45.72 23.18,49.85 v23.5,50.17 23.18,50.48 23.18,51.44 | 23.18,45.72 23.18,45.4 v23.5,45.09 23.18,44.77 23.18,42.86 v23.5,42.55 23.18,42.23 23.18,40.32 v23.5,40.01 23.18,39.69 23.18,37.78 v23.5,37.47 23.18,37.15 23.18,35.24 v23.5,34.93 23.18,34.61 23.18,32.7 v23.5,32.38 23.18,32.07 23.18,30.16 v23.5,29.84 23.18,29.53 23.18,27.62 v23.5,27.3 23.18,26.99 23.18,25.08 v23.5,24.77 23.18,24.45 23.18,22.54 v23.5,22.22 23.18,21.91 23.18,20 v23.5,19.68 | 23.18,45.58 23.18,45.72 | v3.17,32.38 3.49,32.7 3.49,34.61 v3.17,34.93 3.49,35.24 3.49,37.15 v3.17,37.47 3.49,37.78 3.49,39.69 v3.17,40.01 3.49,40.32 3.49,42.23 v3.17,42.55 3.49,42.86 3.49,45.4 3.67,45.58 U1.1 | 23.18,51.44 23.18,52.39 v23.5,52.71 | 23.81,51.44 23.18,51.44 | v23.5,19.68 23.18,19.37 | v23.5,12.06 23.18,11.75 23.18,10.16 | 23.18,10.16 23.18,9.84 v23.5,9.53 23.18,9.21 23.18,7.3 v23.5,6.98 23.18,6.67 23.18,4.76 v23.5,4.45 23.18,4.13 23.18,2.22 v23.5,1.91 | 23.18,12.38 v23.5,12.06 | 23.18,12.38 23.18,13.97 23.5,14.29 v23.5,14.61 23.5,14.92 23.18,15.24 23.18,15.88 | 23.18,12.38 v23.5,12.06 | 23.18,19.37 v23.5,19.68 | 23.18,15.88 23.18,16.51 23.5,16.83 v23.5,17.14 23.5,17.46 23.18,17.78 23.18,17.94 23.18,18.1 | R9.1 23.18,16.01 23.18,15.88 | 23.18,19.37 23.18,18.1 | C2.1 21.59,9.84 21.91,10.16 23.18,10.16 | 3.49,23.18 3.49,24.77 | 3.49,32.07 v3.17,32.38 | C12.1 3.49,23.18 | 3.49,24.77 C13.1 5.9,25.27 6.11,25.48 U3.1 | 3.49,24.77 3.49,32.07 | 3.49,32.07 v3.17,32.38 | U1.40 23.18,45.58 | 23.18,45.58 23.18,45.72 | v19.37,34.29 15.88,34.29 15.56,34.61 v13.65,34.61 | U1.1.4 U1.1.5 | U1.1.5 U1.1.6 | U1.1.6 U1.1.5
  Top 0.305: U1.1.18 U1.1.6 | v11.75,34.61 v7.3,34.61 | 23.18,18.1 21.11,18.1 19.53,16.51 19.53,15.24 | 19.53,15.24 19.53,14.13 | 19.53,14.13 19.53,13.02 | C8.1 19.53,14.13 | R10.1 19.53,15.24 | 3.49,19.37 3.49,17.46 v3.17,17.14 3.49,16.83 3.49,15.56 | 3.49,19.37 3.49,23.18 | C10.1 10.35,18.92 11.43,20 v12.06,20 | 6.24,19.37 3.49,19.37 | R7.1 3.49,15.37 3.49,15.56 | 3.49,15.56 3.49,9.68 | 3.49,9.68 3.49,9.53 3.33,9.37 3.33,7.14 v3.17,6.98 3.33,6.83 3.33,4.6 v3.17,4.45 | C1.1 4.95,9.34 4.6,9.68 3.49,9.68
  Top 0.406: 19.05,13.02 TZ1.1 | SW2.2 19.56,4.13 | 19.56,4.13 SW2.1 | USB1.S4 17.68,4.13 19.56,4.13 | C10.1 9.53,18.41 8.94,17.83 | C11.1 18.1,24.45 18.41,24.77 v23.5,24.77 | 9.05,12.83 C3.1 9.05,12.99 v9.05,13.97 | v14.29,15.56 12.84,15.56 12.84,16.51 12.22,16.51 12.22,16.99 12.38,16.99 v12.38,17.46 | SW1.1 7.11,5.52 v6.83,5.24
  Top 0.61: C5.1 R6.1 C6.1 18.39,12.83 18.57,13.02 | 18.57,13.02 19.05,13.02 | C7.1 19.71,12.83 19.53,13.02 18.57,13.02 | C3.1 R3.1 C4.1 | USB1.A1B12 9.43,9.28 9.02,8.86 USB1.S1 9.02,7.74 8.18,6.91 SW1.1 | USB1.S4 USB1.S2 17.66,8.86 17.24,9.28 USB1.B1A12 | USB1.S3 9.02,2.98 8.64,2.61 SW1.2 | U1.1 5.89,45.58 6.03,45.72 v6.99,45.72 | U1.40 21.09,45.58 20.95,45.72 v20.32,45.72 | 8.94,17.83 C9.1 7.41,17.83 6.99,18.26 6.99,18.63 6.24,19.37 | U3.1 v13.49,25.48
  Top 0.813: J2.P1 23.81,51.44 | U1.1.11 11.84,40.24 11.75,40.32 v11.75,40.96 | U1.1.11 U1.1.1 U1.1.4 | U1.1.11 U1.1.3 U1.1.6 | U1.1.6 U1.1.18 10.48,36.46 10.48,36.51 | U1.1.4 U1.1.7 | U1.1.4 U1.1.5 | U1.1.5 U1.1.6 | U1.1.11 U1.1.5 | U1.1.5 U1.1.8 11.84,35.33 11.75,35.24 v11.75,34.61
  Bottom 0.305: v6.99,45.72 v7.94,45.72 v8.89,45.72 v9.84,45.72 v10.79,45.72 v11.75,45.72 v12.7,45.72 | v12.7,45.72 v13.65,45.72 v14.61,45.72 v15.56,45.72 v16.51,45.72 v17.46,45.72 v18.41,45.72 v19.37,45.72 v20.32,45.72 | v12.7,42.86 v12.7,41.91 | v12.7,43.82 v12.7,42.86 | v12.7,43.82 v12.7,44.77 | v12.7,44.77 v12.7,45.72 | v12.7,44.77 v11.75,44.77 CB2.1 | v12.7,44.77 v13.65,44.77 v14.61,44.77 v15.56,44.77 v16.51,44.77 v17.46,44.77 v18.41,44.77 v19.37,44.77 | CB1.1 12.7,43.18 v12.7,42.86 | v12.7,41.91 v11.75,41.91 v10.79,41.91 v9.84,41.91 | v12.7,41.91 v13.65,41.91 v14.61,41.91 v15.56,41.91 v16.51,41.91 v17.46,41.91 | v12.7,42.86 v13.65,42.86 v14.61,42.86 v15.56,42.86 v16.51,42.86 v17.46,42.86 v18.41,42.86 | v12.7,43.82 v13.65,43.82 v14.61,43.82 v15.56,43.82 v16.51,43.82 v17.46,43.82 v18.41,43.82 v19.37,43.82 | 7.93,3.4 7.93,2.54 8.26,2.54 | 8.26,2.54 v9.84,2.54 v10.79,2.54 v11.75,2.54 | v11.75,2.54 v12.7,2.54 | v12.7,2.54 v13.97,2.54 | v13.97,2.54 v14.92,2.54 | v14.92,2.54 v15.88,2.54 v16.83,2.54 18.64,2.54 JB1.G1 | v11.75,2.54 v11.75,3.49 v11.75,4.45 | v12.7,2.54 v12.7,3.49 v12.7,4.45 | v13.97,2.54 v13.97,3.49 v13.97,4.45 | v14.92,2.54 v14.92,3.49 v14.92,4.45 | v15.56,40.96 v15.56,40.01 v15.56,39.05 v15.56,38.1 v15.56,37.15 v15.56,36.2 | v19.37,34.29 v19.37,33.34 | v19.37,33.34 v19.37,32.38 | v19.37,33.34 v18.41,33.34 v18.41,32.38 | v18.41,32.38 v18.41,31.43 | v17.46,32.38 v18.41,32.38 | U1.1.5 U1.1.6 U1.1.18 | v12.7,34.61 v13.65,34.61 | v7.3,33.66 v7.3,34.61 | v11.75,34.61 v12.7,34.61 | v12.7,33.66 v12.7,34.61 | v12.7,40.96 v11.75,40.96 v10.79,40.96 v9.84,40.96 | v12.7,40.96 v12.7,41.91 | v12.7,40.96 v13.65,40.96 v14.61,40.96
  Bottom 0.305: v15.56,40.96 v14.61,40.96 | v16.51,40.96 v15.56,40.96 | v14.61,40.96 v14.61,40.01 v14.61,39.05 v14.61,38.1 v14.61,37.15 v14.61,36.2 v14.61,35.24 | v3.17,1.91 8.26,1.91 8.26,2.54
  Bottom 0.406: v23.5,1.91 22.23,1.91 20.63,3.5 JB1.G1 | 7.93,4.11 7.93,4.61 7.3,5.24 v6.83,5.24 | v9.05,13.97 9.21,13.97 12.38,17.14 v12.38,17.46 12.38,19.05 12.06,19.37 v12.06,20
  Bottom 0.61: 17.66,8.86 USB1.S2 18.64,8.29 JB1.G3 18.41,8.8 18.41,9.84 16.34,9.84 16.34,10.18 | 7.93,4.11 USB1.S3 9.02,3.5 JB1.G2 7.93,3.4 | JB1.G1 18.64,4.11 USB1.S4 | JB1.G4 9.02,8.8 USB1.S1
  Bottom 0.813: U1.1.8 11.84,35.33 11.75,35.24 v11.75,34.61 | U1.1.8 U1.1.18 U1.1.6 | U1.1.8 U1.1.7 U1.1.4 | U1.1.4 U1.1.1 U1.1.11 | U1.1.11 U1.1.3 U1.1.6 | U1.1.8 U1.1.5 | U1.1.5 U1.1.11 | U1.1.4 U1.1.5 | U1.1.5 U1.1.6
  Bottom 1.016: JB1.1 16.34,10.18
  pour Top: 0,1.27 26.67,1.27 26.67,53.34 23.5,53.34 23.5,46.04 3.17,46.04 3.17,53.34 0,53.34
  pour Bottom: 0,1.27 26.67,1.27 26.67,53.34 23.5,53.34 23.5,46.04 3.17,46.04 3.17,53.34 0,53.34
  pour Route15: 0,1.27 26.67,1.27 26.67,53.34 23.5,53.34 23.5,46.04 3.17,46.04 3.17,53.34 0,53.34
IO0  (via drill 0.5)
  Top 0.406: R2.1 v20.64,8.44 | v20.64,8.44 20.64,7.3 21.03,6.91 SW2.4 SW2.3 | C2.2 v20.64,8.44 | Q1.C 20.27,18.68 Q1.C | Q1.C 22.18,18.68 22.54,19.05 v22.54,19.68 | v18.26,19.37 19.64,19.37 Q1.C
  Top 0.61: U1.27 20.3,29.07 19.37,30 v19.37,30.8
  Bottom 0.406: J2.P14 23.5,18.41 22.54,19.37 v22.54,19.68 22.54,20.95 21.91,21.59 21.91,23.18 21.27,23.81 21.27,25.4 20.64,26.04 20.64,27.62 19.37,28.89 v19.37,30.8 | v20.64,8.44 20.64,12.06 19.05,13.65 19.05,17.14 18.26,17.94 v18.26,19.37
IO1  (via drill 0.5)
  Top 0.61: U1.39 v20.32,44.31
  Bottom 0.406: J2.P2 24.77,48.58 21.91,45.72 21.91,44.45 21.27,43.82 20.64,43.82 20.32,44.13 v20.32,44.31
IO2  (via drill 0.5)
  Top 0.61: U1.38 v20.32,43.04 19.86,43.04 19.05,42.23 v19.05,40.96
  Bottom 0.406: v20.32,43.04 21.69,43.04 22.54,43.89 22.54,45.4 23.5,46.36 J2.P3 | JB1.4 10.34,12.88 14.45,16.99 14.45,19.68 15.88,21.11 15.88,22.7 14.45,24.13 14.45,27.15 13.34,28.26 13.34,30.8 18.73,36.2 18.73,40.64 v19.05,40.96
IO3  (via drill 0.5)
  Top 0.61: U1.15 v6.35,29.21
  Bottom 0.406: v6.35,29.21 6.35,27.94 4.76,26.35 4.76,24.77 4.13,24.13 4.13,22.54 3.49,21.91 3.49,20.32 1.91,18.73 J1.P14
IO4  (via drill 0.5)
  Top 0.61: U1.4 v6.35,41.77
  Bottom 0.406: J1.P3 1.91,46.04 6.17,41.77 v6.35,41.77
IO5  (via drill 0.5)
  Top 0.61: U1.5 v6.03,40.5
  Bottom 0.406: J1.P4 3.17,43.82 5.4,41.59 5.4,40.96 5.85,40.5 v6.03,40.5
IO6  (via drill 0.5)
  Top 0.61: U1.6 v6.03,39.23
  Bottom 0.406: v6.03,39.23 5.22,39.23 3.17,41.28 J1.P5
IO7  (via drill 0.5)
  Top 0.61: U1.7 v6.03,37.96
  Bottom 0.406: v6.03,37.96 3.95,37.96 3.17,38.74 J1.P6
IO8  (via drill 0.5)
  Top 0.61: U1.12 v6.03,31.61
  Bottom 0.406: v6.03,31.61 5.58,31.61 3.49,29.53 3.49,27.94 1.91,26.35 J1.P11
IO9  (via drill 0.5)
  Top 0.61: U1.17 8.89,28.89 7.94,29.84 v7.3,29.84
  Bottom 0.406: J1.P15 3.17,15.88 4.13,16.83 4.13,21.59 4.76,22.22 4.76,23.81 5.4,24.45 5.4,26.04 7.62,28.26 7.62,29.53 v7.3,29.84
IO10  (via drill 0.5)
  Top 0.61: U1.18 10.16,28.89 8.26,30.8 v7.62,30.8
  Bottom 0.406: v7.62,30.8 8.26,30.16 8.26,27.94 6.03,25.72 6.03,24.13 5.4,23.5 5.4,21.91 4.76,21.27 4.76,16.51 1.91,13.65 J1.P16
IO11  (via drill 0.5)
  Top 0.61: U1.19 11.43,28.89 8.57,31.75 v7.94,31.75
  Bottom 0.406: v7.94,31.75 8.57,31.75 8.89,31.43 8.89,27.62 6.67,25.4 6.67,23.81 6.03,23.18 6.03,21.59 5.4,20.95 5.4,16.19 3.49,14.29 3.49,12.7 1.91,11.11 J1.P17
IO12  (via drill 0.5)
  Top 0.61: U1.20 12.7,28.89 8.89,32.7 v8.26,32.7
  Bottom 0.406: J1.P18 1.91,8.57 3.49,10.16 3.49,11.75 4.13,12.38 4.13,13.97 6.03,15.88 6.03,20.64 6.67,21.27 6.67,22.86 7.3,23.5 7.3,25.08 9.53,27.3 9.53,32.07 8.89,32.7 v8.26,32.7
IO13  (via drill 0.5)
  Top 0.61: U1.21 13.97,29.53 15.56,31.11 v16.03,31.11
  Bottom 0.406: J2.P19 23.5,5.71 22.54,6.67 22.54,8.26 21.91,8.89 21.91,10.48 21.27,11.11 21.27,12.38 19.68,13.97 19.68,17.46 19.05,18.1 19.05,19.68 18.73,20 18.73,21.59 18.1,22.22 18.1,23.81 17.46,24.45 17.46,26.04 14.61,28.89 14.61,30.16 15.56,31.11 v16.03,31.11
IO14  (via drill 0.5)
  Top 0.61: U1.22 15.24,29.21 v15.56,29.53
  Bottom 0.406: J2.P18 23.5,8.26 22.54,9.21 22.54,10.79 21.91,11.43 21.91,12.7 20.32,14.29 20.32,17.78 19.68,18.41 19.68,20 19.37,20.32 19.37,21.91 18.73,22.54 18.73,24.13 18.1,24.77 18.1,26.35 15.56,28.89 v15.56,29.53
IO15  (via drill 0.5)
  Top 0.61: U1.8 v6.03,36.69
  Bottom 0.406: v6.03,36.69 3.67,36.69 3.17,36.2 J1.P7
IO16  (via drill 0.5)
  Top 0.61: U1.9 v6.03,35.42
  Bottom 0.406: v6.03,35.42 4.94,35.42 3.17,33.66 J1.P8
IO17  (via drill 0.5)
  Top 0.61: U1.10 v6.03,34.15
  Bottom 0.406: v6.03,34.15 6.03,33.97 3.17,31.11 J1.P9
IO18  (via drill 0.5)
  Top 0.61: U1.11 v6.35,32.88
  Bottom 0.406: v6.35,32.88 5.89,32.88 1.91,28.89 J1.P10
IO19  (via drill 0.5)
  Top 0.61: U1.13 v5.87,30.34
  Bottom 0.406: v5.87,30.34 5.26,30.34 4.13,29.21 4.13,27.62 3.49,26.99 3.49,25.4 1.91,23.81 J1.P12
IO20  (via drill 0.5)
  Top 0.61: U1.14 4.58,28.43 v5.08,27.94
  Bottom 0.406: v5.08,27.94 5.08,27.62 4.13,26.67 4.13,25.08 3.49,24.45 3.49,22.86 1.91,21.27 J1.P13
IO21  (via drill 0.5)
  Top 0.61: U1.23 v16.51,30.16
  Bottom 0.406: J2.P17 23.5,10.79 22.54,11.75 22.54,13.02 20.95,14.61 20.95,18.1 20.32,18.73 20.32,20.32 20,20.64 20,22.22 19.37,22.86 19.37,24.45 18.73,25.08 18.73,26.67 16.51,28.89 v16.51,30.16
IO35  (via drill 0.5)
  Top 0.61: U1.28 v20.32,30.34
  Bottom 0.406: J2.P13 23.5,20.95 22.54,21.91 22.54,23.5 21.91,24.13 21.91,25.72 21.27,26.35 21.27,27.94 20.32,28.89 v20.32,30.34
IO36  (via drill 0.5)
  Top 0.61: U1.29 v20,31.61
  Bottom 0.406: J2.P12 23.5,23.5 22.54,24.45 22.54,26.04 21.91,26.67 21.91,28.26 21.27,28.89 21.27,30.48 20.14,31.61 v20,31.61
IO37  (via drill 0.5)
  Top 0.61: U1.30 v20.32,32.88
  Bottom 0.406: J2.P11 23.5,26.04 22.54,26.99 22.54,28.57 21.91,29.21 21.91,30.8 21.27,31.43 21.27,32.38 20.77,32.88 v20.32,32.88
IO38  (via drill 0.5)
  Top 0.61: U1.31 v20.32,34.15
  Bottom 0.406: J2.P10 23.5,28.57 22.54,29.53 22.54,31.11 21.91,31.75 21.91,33.34 21.09,34.15 v20.32,34.15
IO39  (via drill 0.5)
  Top 0.61: U1.32 v20.32,35.42
  Bottom 0.406: J2.P9 23.5,31.11 22.54,32.07 22.54,33.66 20.77,35.42 v20.32,35.42
IO40  (via drill 0.5)
  Top 0.61: U1.33 v20.32,36.69
  Bottom 0.406: J2.P8 23.5,33.66 20.46,36.69 v20.32,36.69
IO41  (via drill 0.5)
  Top 0.61: U1.34 v20.32,37.96
  Bottom 0.406: v20.32,37.96 20.46,37.96 22.23,36.2 J2.P7
IO42  (via drill 0.5)
  Top 0.61: U1.35 v20.32,39.23
  Bottom 0.406: J2.P6 23.5,38.74 22.86,39.37 21.95,39.37 21.75,39.17 21.75,38.26 21.59,38.1 21.27,38.1 21.11,38.26 21.11,39.05 20.93,39.23 v20.32,39.23 19.86,39.23 19.37,38.74 19.37,35.88 19.05,35.56 19.05,35.24 18.89,35.08 18.57,35.08 18.41,34.93 18.41,34.61 18.26,34.45 17.94,34.45 17.78,34.29 17.78,33.97 17.62,33.81 17.3,33.81 17.14,33.66 17.14,33.34 16.99,33.18 16.67,33.18 16.51,33.02 16.51,32.7 16.35,32.54 16.03,32.54 15.88,32.38 15.88,32.07 15.72,31.91 15.4,31.91 13.97,30.48 13.97,28.57 15.08,27.46 15.08,27.15 15.24,26.99 15.56,26.99 15.72,26.83 15.72,26.51 15.56,26.35 15.24,26.35 15.08,26.19 15.08,24.45 16.51,23.02 16.51,20.8 15.08,19.37 15.08,13.49 14.92,13.33 14.61,13.33 14.45,13.49 13.65,13.49 13.49,13.33 13.18,13.33 13.02,13.49 13.02,13.81 12.86,13.97 12.54,13.97 12.34,13.76 JB1.3
IO45
  Top 0.406: U1.26 21.39,27.82 22.23,26.99 J4.P$1
IO46
  Top 0.406: U1.16 7.62,26.67 6.99,26.04 J3.P$1
IO47  (via drill 0.5)
  Top 0.406: v22.54,14.61 22.09,14.61 R9.2
  Top 0.61: U1.24 17.78,28.89 17.46,29.21 v17.46,30.8
  Bottom 0.406: v17.46,30.8 17.46,28.89 19.37,26.99 19.37,25.4 20,24.77 20,23.18 20.64,22.54 20.64,20.95 20.95,20.64 20.95,19.05 21.59,18.41 21.59,14.92 21.91,14.61 v22.54,14.61 22.54,14.29 23.5,13.33 J2.P16
IO48  (via drill 0.5)
  Top 0.406: v22.54,17.14 20.95,17.14 20.32,16.51 R8.1
  Top 0.61: U1.25 19.05,28.89 18.41,29.53 v18.41,30.16
  Bottom 0.406: 22.54,17.78 22.54,18.41 21.59,19.37 21.59,20.95 21.27,21.27 21.27,22.86 20.64,23.5 20.64,25.08 20,25.72 20,27.3 18.41,28.89 v18.41,30.16 | 22.54,17.78 v22.54,17.14 | v22.54,17.14 22.54,17.78 | v22.54,17.14 22.54,16.83 23.5,15.88 J2.P15
N$1
  Top 0.254: U2.5 13.84,13.47 13.97,13.33 R5.2
N$2
  Top 0.254: U2.4 13.34,13.47 R4.2
N$3
  Top 0.61: C10.2 9.53,20.88
  Top 0.813: 7.94,20 C9.2
  Top 1.016: U3.3 9.53,20.88 7.94,20.88 | 7.94,20.88 F1.2 | 7.94,20.88 7.94,20
N$4
  Top 0.61: LED1.1 R7.2
N$5
  Top 0.61: LED2.1 21.48,13.13 20.32,14.29 R8.2
N$6
  Top 0.61: R13.2 Q2.B
N$7
  Top 0.61: R14.2 Q1.B
N$8
  Top 0.254: U2.9 16.3,15.51 16.59,15.8 16.59,16.91 17.46,17.78 R12.2
N$10
  Top 0.254: U2.8 16.44,15.01 16.67,15.24 R10.2
  Top 0.305: R10.2 17.96,15.66 18.18,15.88 18.65,15.88 18.86,16.09 R11.2
RTS  (via drill 0.5)
  Top 0.254: R14.1 20.77,22.68 20.32,22.22 20.32,20.48 19.84,20 18.89,20 18.26,20.64 14.61,20.64 14.13,21.11 13.34,21.11 v12.54,21.91 | U2.24 9.98,17.01 v9.68,17.3
  Top 0.61: R14.1 Q2.E
  Bottom 0.406: v12.54,21.91 11.43,21.91 9.84,20.32 9.84,19.68 9.21,19.05 9.21,17.78 v9.68,17.3
RXD  (via drill 0.5)
  Top 0.254: U2.26 9.82,16.01 9.53,15.72 v8.41,15.72
  Top 0.406: v17.22,39.53 18.87,39.53 19.84,40.5 v20.32,40.5
  Top 0.61: U1.36 v20.32,40.5
  Bottom 0.406: J2.P5 23.1,41.28 22.54,40.72 22.54,40.32 22.38,40.16 21.61,40.16 21.27,40.5 v20.32,40.5 | v8.41,15.72 7.94,16.19 7.94,19.68 8.57,20.32 8.57,20.95 10.79,23.18 10.79,24.77 12.06,26.04 12.06,31.43 17.22,36.59 v17.22,39.53
TXD  (via drill 0.5)
  Top 0.254: U2.25 v9.05,16.51
  Top 0.61: U1.37 v20.32,41.77
  Bottom 0.406: J2.P4 23.5,43.82 21.45,41.77 v20.32,41.77 18.44,41.77 18.1,41.43 18.1,36.51 12.7,31.11 12.7,25.72 11.43,24.45 11.43,23.97 11.59,23.81 11.75,23.81 11.91,23.65 11.91,23.02 11.75,22.86 11.43,22.86 9.21,20.64 9.21,20 8.57,19.37 8.57,16.99 v9.05,16.51
V_USB  (via drill 0.5, 0.6, 0.8)
  Top 0.406: R11.1 v17.3,16.51
  Top 0.61: USB1.B4A9 15.79,10.07 16.19,10.48 17.14,10.48 v17.78,11.11 C6.2 | USB1.A4B9 10.88,10.07 10.48,10.48 10.16,10.48 9.53,11.11 v8.89,11.11 C3.2 | 6.67,11.11 D1.2 | v13.49,20.16 14.13,20.16 14.29,20 15.72,20 16.03,19.68 v16.03,19.05 | v5.24,4.45 5.24,4.92 6.19,5.87 v6.19,7.62
  Top 0.813: D1.2 8.89,11.13 v8.89,11.11
  Bottom 0.61: v17.78,11.11 17.78,12.54 17.14,13.18 16.35,13.18 15.88,13.65 15.88,14.92 16.35,15.4 16.99,15.4 17.3,15.72 v17.3,16.51 16.03,17.78 v16.03,19.05 | v13.49,20.16 13.49,17.14 8.89,12.54 v8.89,11.11 7.46,11.11 6.83,10.48 6.83,8.41 6.19,7.78 v6.19,7.62 | v5.24,4.45 5.24,3.97 JB2.P$1

### Text on the board
tNames: LAMLOEI | NODE32S3 | CP2102 | 46 | 45 | 19 | 20 | 36 | 35 | 3 | 0 | 9 | 48 | 47 | 11 | P | 48 | 21 | 12 | 5V | 14 | 13 | D- | D+ | E | B
bNames: 3V3 | EN | GND | 1 | 4 | 2 | 5 | 43TXD | 6 | 44RXD | 7 | 42 | 15 | 41 | 16 | 17 | 40 | 39 | 18 | 8 | 38 | 37 | 19 | 20 | 36 | 35 | 3 | NODE32S3 | LAMLOEI | 9 | 0 | 48 | 10 | SCL | SDA | 5V | GND | 47 | 11 | 21 | 12 | 14 | 5V | D | 13 | D+
tDocu: U1 | ESP32-S3-WROOM | J1 | J3 | J4 | J2 | C13 | 100n | Q2 | C12 | U3 | C11 | 22u | LM1117MPX | 100n | R13 | R14 | 12K | 12K | C9 | C10 | Q1 | F1 | 100n | 22u | R12 | 12K | CP2102 | U2 | R11 | 24K | R8 | R9 | R7 | R10 | 47K | 2K2 | 12K | 2K2 | C8 | LED1 | TZ1 | 100n | LED2 | D1 | C3 | R3 | C4 | R4 | R5 | C5 | R6 | C6 | C7 | BLU | 100n | 5K1 | 47p | 27 | 27 | 47p | 5K1 | 100n | 100n | YEL | C1 | R1 | R2 | C2 | 1u | 12K | 12K | 100n | USB1 | SW1 | SW2
bDocu: 100n | CB2 | 22u | CB1 | JB1